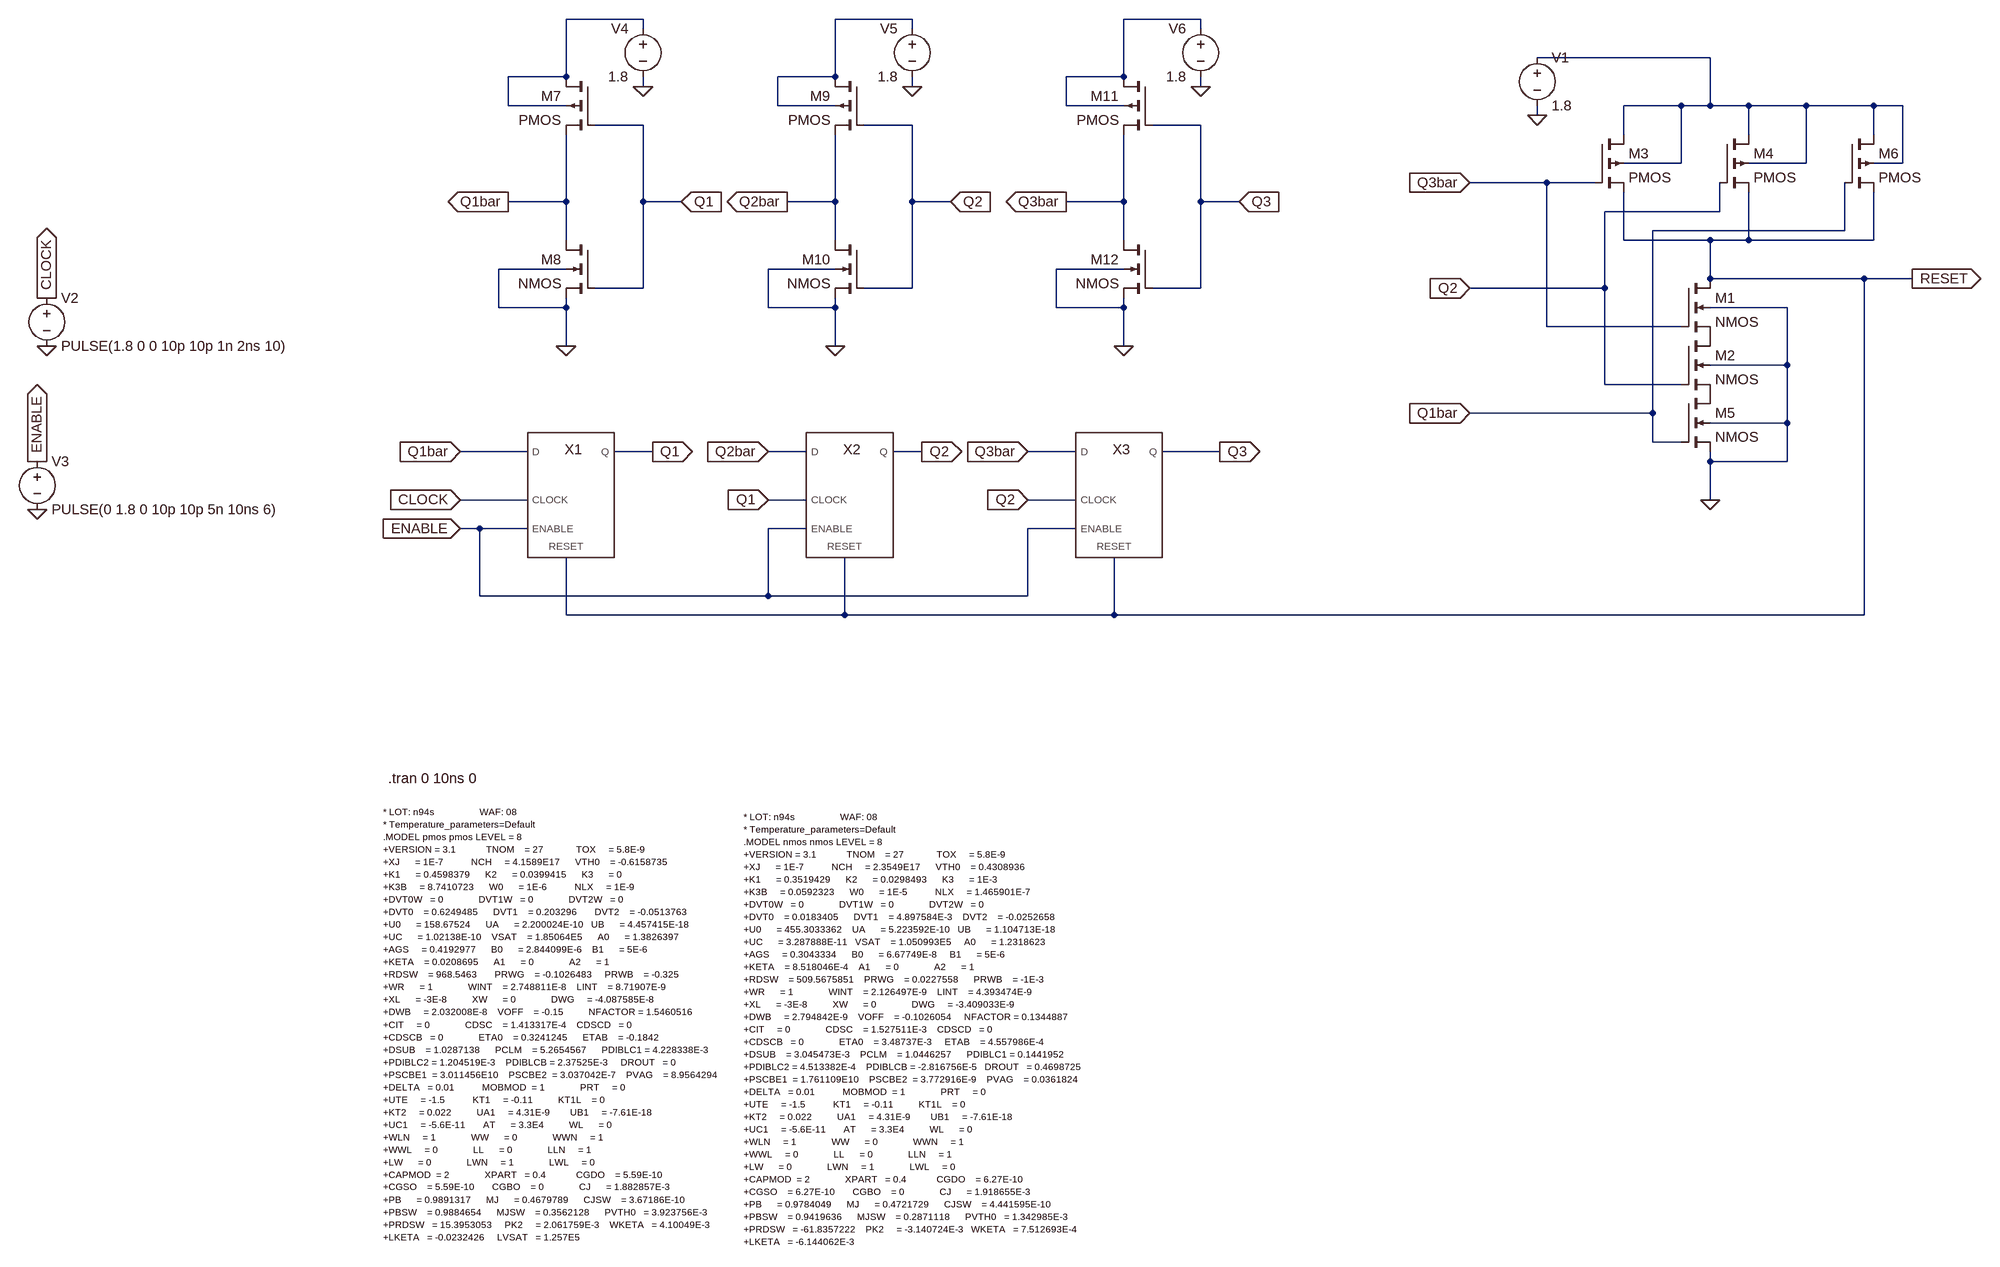
[diagram p0: schematic Mod5_Counter.asc]
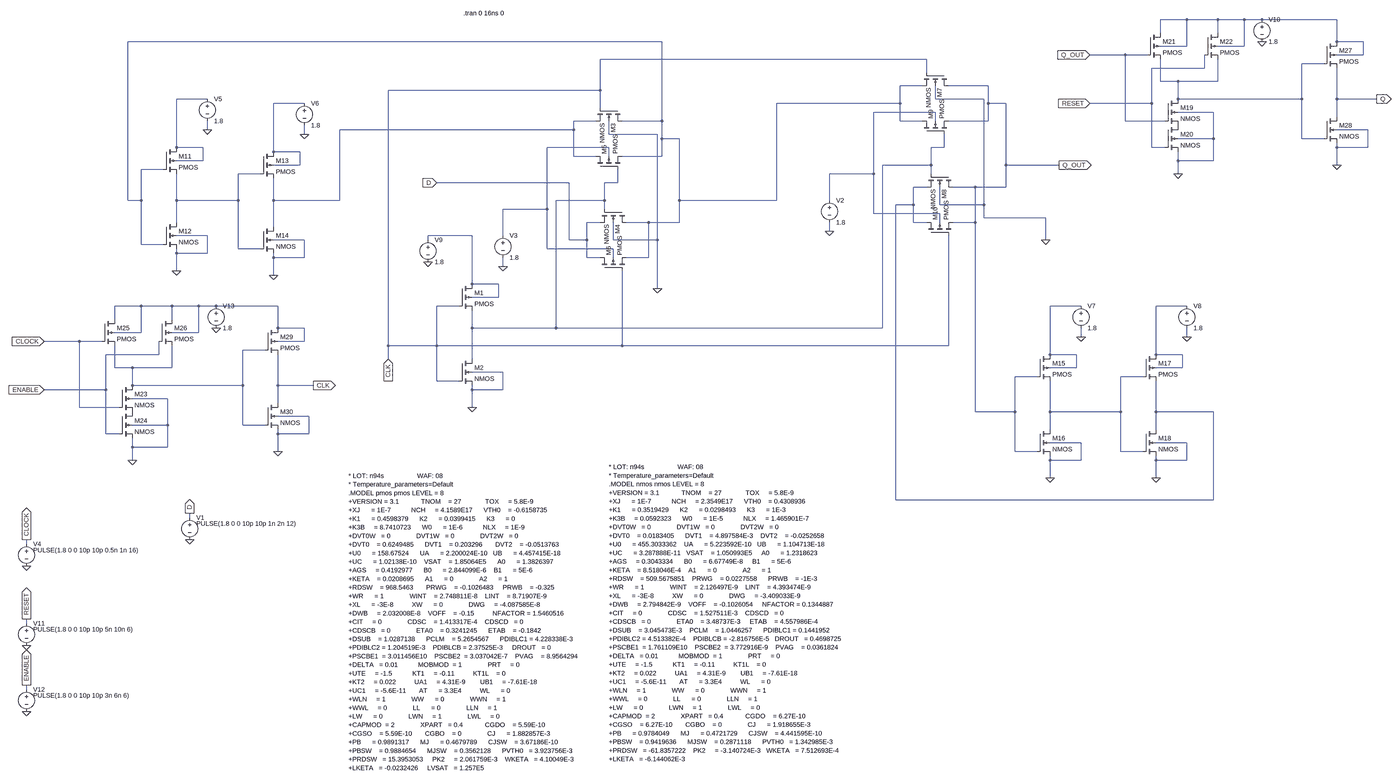
[diagram p1: sub-circuit dff_with_cntrs.asc, whole sheet]
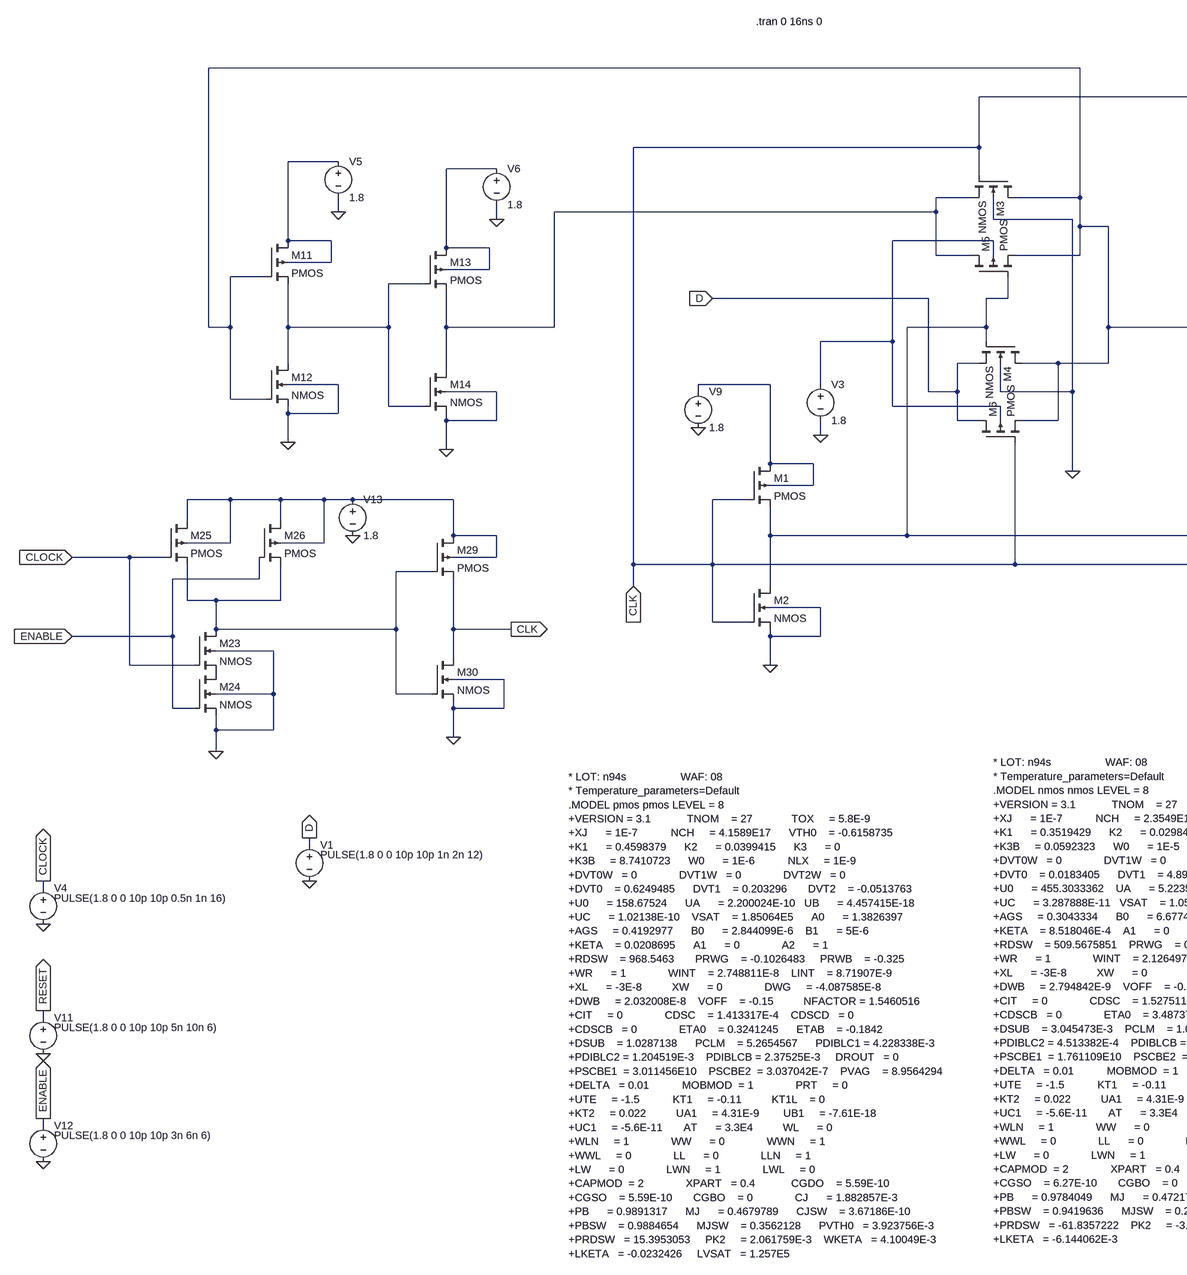
[diagram p2: sub-circuit dff_with_cntrs.asc, part, row 1 of 1, column 1 of 2]
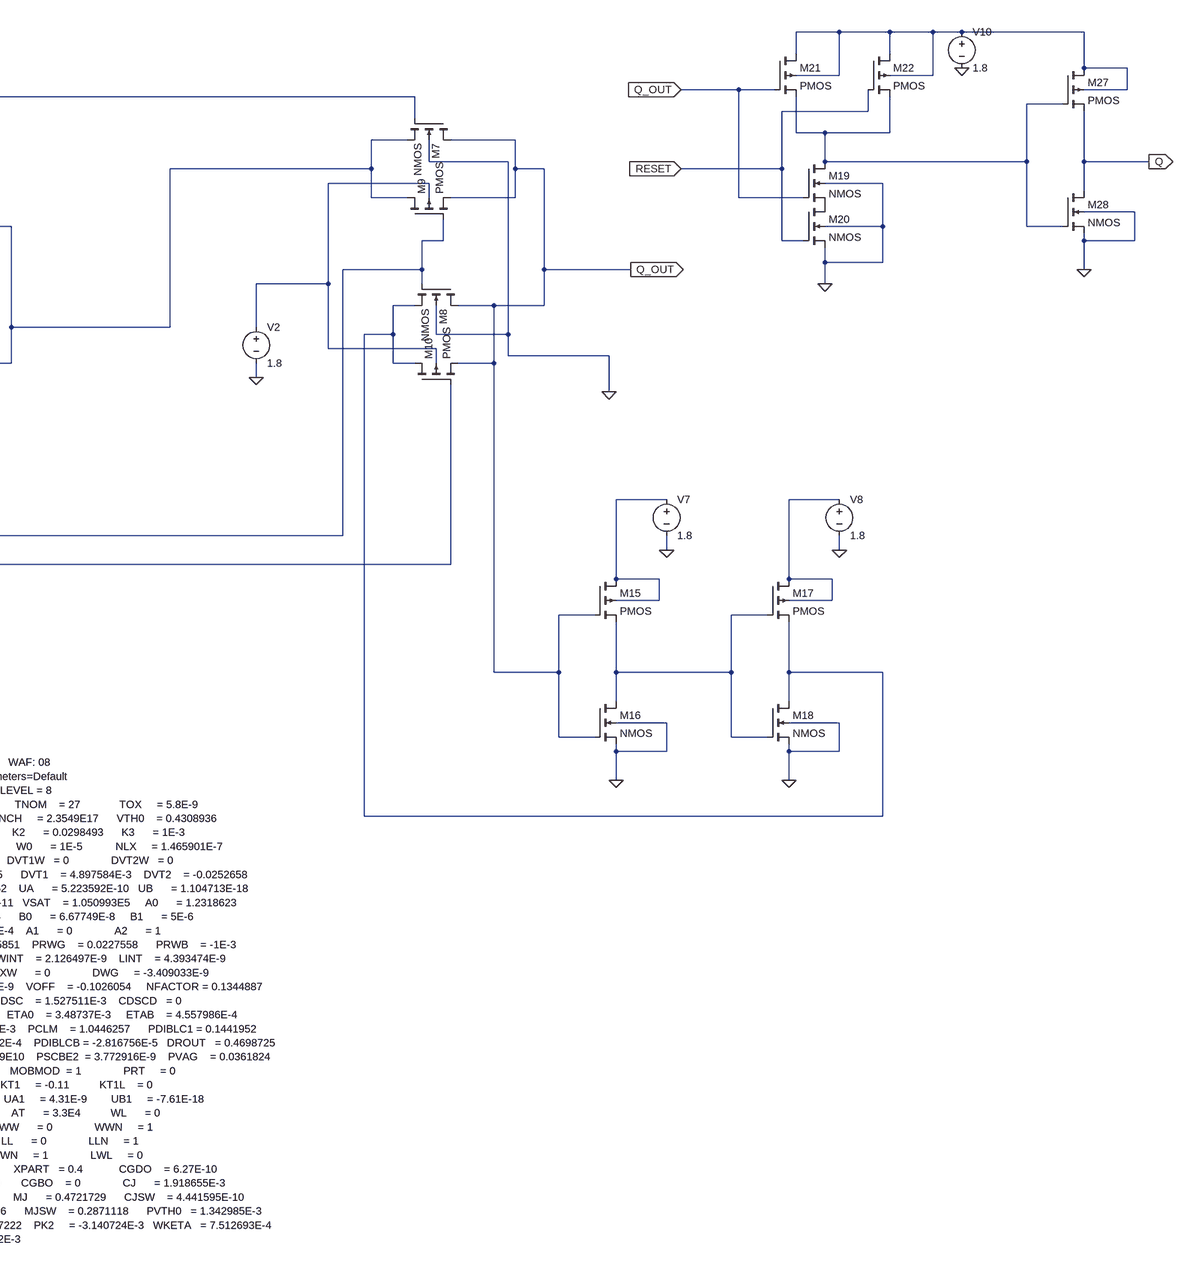
[diagram p3: sub-circuit dff_with_cntrs.asc, part, row 1 of 1, column 2 of 2]
Mod5_Counter.asc, the LTspice schematic file:
Version 4
SHEET 1 2244 1640
WIRE 16 -208 -112 -208
WIRE 464 -208 336 -208
WIRE 944 -208 816 -208
WIRE 16 -192 16 -208
WIRE 464 -192 464 -208
WIRE 944 -192 944 -208
WIRE 1792 -144 1504 -144
WIRE -112 -112 -112 -208
WIRE -112 -112 -208 -112
WIRE 336 -112 336 -208
WIRE 336 -112 240 -112
WIRE 816 -112 816 -208
WIRE 816 -112 720 -112
WIRE 16 -96 16 -112
WIRE 464 -96 464 -112
WIRE 944 -96 944 -112
WIRE -208 -64 -208 -112
WIRE -112 -64 -208 -64
WIRE 240 -64 240 -112
WIRE 336 -64 240 -64
WIRE 720 -64 720 -112
WIRE 816 -64 720 -64
WIRE 1744 -64 1648 -64
WIRE 1792 -64 1792 -144
WIRE 1792 -64 1744 -64
WIRE 1856 -64 1792 -64
WIRE 1952 -64 1856 -64
WIRE 2064 -64 1952 -64
WIRE 2112 -64 2064 -64
WIRE 1504 -48 1504 -64
WIRE 16 -32 -64 -32
WIRE 464 -32 384 -32
WIRE 944 -32 864 -32
WIRE 1648 -16 1648 -64
WIRE 1856 -16 1856 -64
WIRE 2064 -16 2064 -64
WIRE 1744 32 1744 -64
WIRE 1744 32 1648 32
WIRE 1952 32 1952 -64
WIRE 1952 32 1856 32
WIRE 2112 32 2112 -64
WIRE 2112 32 2064 32
WIRE 1520 64 1392 64
WIRE 1600 64 1520 64
WIRE -112 96 -112 -16
WIRE -112 96 -208 96
WIRE 16 96 16 -32
WIRE 80 96 16 96
WIRE 336 96 336 -16
WIRE 336 96 256 96
WIRE 464 96 464 -32
WIRE 528 96 464 96
WIRE 816 96 816 -16
WIRE 816 96 720 96
WIRE 944 96 944 -32
WIRE 1008 96 944 96
WIRE 1808 112 1808 64
WIRE 1808 112 1616 112
WIRE 2016 144 2016 64
WIRE 2016 144 1696 144
WIRE -112 160 -112 96
WIRE 336 160 336 96
WIRE 816 160 816 96
WIRE 1648 160 1648 80
WIRE 1792 160 1648 160
WIRE 1856 160 1856 80
WIRE 1856 160 1792 160
WIRE 2064 160 2064 80
WIRE 2064 160 1856 160
WIRE -112 208 -224 208
WIRE 336 208 224 208
WIRE 816 208 704 208
WIRE 1792 224 1792 160
WIRE 2048 224 1792 224
WIRE 2128 224 2048 224
WIRE 16 240 16 96
WIRE 16 240 -64 240
WIRE 464 240 464 96
WIRE 464 240 384 240
WIRE 944 240 944 96
WIRE 944 240 864 240
WIRE 1616 240 1616 112
WIRE 1616 240 1392 240
WIRE -224 272 -224 208
WIRE -112 272 -112 256
WIRE -112 272 -224 272
WIRE 224 272 224 208
WIRE 336 272 336 256
WIRE 336 272 224 272
WIRE 704 272 704 208
WIRE 816 272 816 256
WIRE 816 272 704 272
WIRE 1920 272 1792 272
WIRE 1520 304 1520 64
WIRE 1744 304 1520 304
WIRE -112 336 -112 272
WIRE 336 336 336 272
WIRE 816 336 816 272
WIRE 1920 368 1920 272
WIRE 1920 368 1792 368
WIRE 1616 400 1616 240
WIRE 1744 400 1616 400
WIRE 1696 448 1696 144
WIRE 1696 448 1392 448
WIRE 1920 464 1920 368
WIRE 1920 464 1792 464
WIRE 1696 496 1696 448
WIRE 1744 496 1696 496
WIRE -176 512 -288 512
WIRE 32 512 -32 512
WIRE 288 512 224 512
WIRE 480 512 432 512
WIRE 736 512 656 512
WIRE 976 512 880 512
WIRE 1792 528 1792 512
WIRE 1920 528 1920 464
WIRE 1920 528 1792 528
WIRE -176 592 -288 592
WIRE 288 592 224 592
WIRE 736 592 656 592
WIRE 1792 592 1792 528
WIRE -256 640 -288 640
WIRE -176 640 -256 640
WIRE 288 640 224 640
WIRE 736 640 656 640
WIRE -256 752 -256 640
WIRE 224 752 224 640
WIRE 224 752 -256 752
WIRE 656 752 656 640
WIRE 656 752 224 752
WIRE -112 784 -112 688
WIRE 352 784 352 688
WIRE 352 784 -112 784
WIRE 800 784 800 688
WIRE 800 784 352 784
WIRE 2048 784 2048 224
WIRE 2048 784 800 784
FLAG 1504 -48 0
FLAG -976 336 0
FLAG -992 608 0
FLAG 1792 592 0
FLAG -112 336 0
FLAG 16 -96 0
FLAG 336 336 0
FLAG 464 -96 0
FLAG 816 336 0
FLAG 944 -96 0
FLAG 80 96 Q1
IOPIN 80 96 In
FLAG 528 96 Q2
IOPIN 528 96 In
FLAG 1008 96 Q3
IOPIN 1008 96 In
FLAG 1392 64 Q3bar
IOPIN 1392 64 In
FLAG 1392 240 Q2
IOPIN 1392 240 In
FLAG 1392 448 Q1bar
IOPIN 1392 448 In
FLAG 656 512 Q3bar
IOPIN 656 512 In
FLAG 656 592 Q2
IOPIN 656 592 In
FLAG 224 512 Q2bar
IOPIN 224 512 In
FLAG 224 592 Q1
IOPIN 224 592 In
FLAG -288 512 Q1bar
IOPIN -288 512 In
FLAG -288 592 CLOCK
IOPIN -288 592 In
FLAG -288 640 ENABLE
IOPIN -288 640 In
FLAG 32 512 Q1
IOPIN 32 512 Out
FLAG 480 512 Q2
IOPIN 480 512 Out
FLAG 976 512 Q3
IOPIN 976 512 Out
FLAG 720 96 Q3bar
IOPIN 720 96 Out
FLAG 256 96 Q2bar
IOPIN 256 96 Out
FLAG -208 96 Q1bar
IOPIN -208 96 Out
FLAG -976 256 CLOCK
IOPIN -976 256 Out
FLAG -992 528 ENABLE
IOPIN -992 528 Out
FLAG 2128 224 RESET
IOPIN 2128 224 Out
SYMBOL nmos4 1744 224 R0
SYMATTR InstName M1
SYMATTR Value2 l=180n w=1320n
SYMBOL nmos4 1744 320 R0
SYMATTR InstName M2
SYMATTR Value2 l=180n w=1320n
SYMBOL pmos4 1600 -16 R0
SYMATTR InstName M3
SYMATTR Value2 l=180n w=880n
SYMBOL pmos4 1808 -16 R0
SYMATTR InstName M4
SYMATTR Value2 l=180n w=880n
SYMBOL Voltage 1504 -160 R0
SYMATTR InstName V1
SYMATTR Value 1.8
SYMBOL Voltage -976 240 R0
SYMATTR InstName V2
SYMATTR Value PULSE(1.8 0 0 10p 10p 1n 2ns 10)
SYMBOL Voltage -992 512 R0
SYMATTR InstName V3
SYMATTR Value PULSE(0 1.8 0 10p 10p 5n 10ns 6)
SYMBOL nmos4 1744 416 R0
SYMATTR InstName M5
SYMATTR Value2 l=180n w=1320n
SYMBOL pmos4 2016 -16 R0
SYMATTR InstName M6
SYMATTR Value2 l=180n w=880n
SYMBOL pmos4 -64 -112 M0
SYMATTR InstName M7
SYMATTR Value2 l=180n w=880n
SYMBOL nmos4 -64 160 M0
SYMATTR InstName M8
SYMATTR Value2 l=180n w=440n
SYMBOL Voltage 16 -208 M0
SYMATTR InstName V4
SYMATTR Value 1.8
SYMBOL pmos4 384 -112 M0
SYMATTR InstName M9
SYMATTR Value2 l=180n w=880n
SYMBOL nmos4 384 160 M0
SYMATTR InstName M10
SYMATTR Value2 l=180n w=440n
SYMBOL Voltage 464 -208 M0
SYMATTR InstName V5
SYMATTR Value 1.8
SYMBOL pmos4 864 -112 M0
SYMATTR InstName M11
SYMATTR Value2 l=180n w=880n
SYMBOL nmos4 864 160 M0
SYMATTR InstName M12
SYMATTR Value2 l=180n w=440n
SYMBOL Voltage 944 -208 M0
SYMATTR InstName V6
SYMATTR Value 1.8
SYMBOL DFF_With_Cntrs -112 592 R0
WINDOW 0 12 -68 Bottom 2
SYMATTR InstName X1
SYMBOL DFF_With_Cntrs 352 592 R0
WINDOW 0 12 -68 Bottom 2
SYMATTR InstName X2
SYMBOL DFF_With_Cntrs 800 592 R0
WINDOW 0 12 -68 Bottom 2
SYMATTR InstName X3
TEXT -416 1112 Left 1 !* LOT: n94s                  WAF: 08\n* Temperature_parameters=Default\n.MODEL pmos pmos LEVEL = 8\n+VERSION = 3.1            TNOM    = 27             TOX     = 5.8E-9\n+XJ      = 1E-7           NCH     = 4.1589E17      VTH0    = -0.6158735\n+K1      = 0.4598379      K2      = 0.0399415      K3      = 0\n+K3B     = 8.7410723      W0      = 1E-6           NLX     = 1E-9\n+DVT0W   = 0              DVT1W   = 0              DVT2W   = 0\n+DVT0    = 0.6249485      DVT1    = 0.203296       DVT2    = -0.0513763\n+U0      = 158.67524      UA      = 2.200024E-10   UB      = 4.457415E-18\n+UC      = 1.02138E-10    VSAT    = 1.85064E5      A0      = 1.3826397\n+AGS     = 0.4192977      B0      = 2.844099E-6    B1      = 5E-6\n+KETA    = 0.0208695      A1      = 0              A2      = 1\n+RDSW    = 968.5463       PRWG    = -0.1026483     PRWB    = -0.325\n+WR      = 1              WINT    = 2.748811E-8    LINT    = 8.71907E-9\n+XL      = -3E-8          XW      = 0              DWG     = -4.087585E-8\n+DWB     = 2.032008E-8    VOFF    = -0.15          NFACTOR = 1.5460516\n+CIT     = 0              CDSC    = 1.413317E-4    CDSCD   = 0\n+CDSCB   = 0              ETA0    = 0.3241245      ETAB    = -0.1842\n+DSUB    = 1.0287138      PCLM    = 5.2654567      PDIBLC1 = 4.228338E-3\n+PDIBLC2 = 1.204519E-3    PDIBLCB = 2.37525E-3     DROUT   = 0\n+PSCBE1  = 3.011456E10    PSCBE2  = 3.037042E-7    PVAG    = 8.9564294\n+DELTA   = 0.01           MOBMOD  = 1              PRT     = 0\n+UTE     = -1.5           KT1     = -0.11          KT1L    = 0\n+KT2     = 0.022          UA1     = 4.31E-9        UB1     = -7.61E-18\n+UC1     = -5.6E-11       AT      = 3.3E4          WL      = 0\n+WLN     = 1              WW      = 0              WWN     = 1\n+WWL     = 0              LL      = 0              LLN     = 1\n+LW      = 0              LWN     = 1              LWL     = 0\n+CAPMOD  = 2              XPART   = 0.4            CGDO    = 5.59E-10\n+CGSO    = 5.59E-10       CGBO    = 0              CJ      = 1.882857E-3\n+PB      = 0.9891317      MJ      = 0.4679789      CJSW    = 3.67186E-10\n+PBSW    = 0.9884654      MJSW    = 0.3562128      PVTH0   = 3.923756E-3\n+PRDSW   = 15.3953053     PK2     = 2.061759E-3    WKETA   = 4.10049E-3\n+LKETA   = -0.0232426     LVSAT   = 1.257E5
TEXT 184 1120 Left 1 !* LOT: n94s                  WAF: 08\n* Temperature_parameters=Default\n.MODEL nmos nmos LEVEL = 8\n+VERSION = 3.1            TNOM    = 27             TOX     = 5.8E-9\n+XJ      = 1E-7           NCH     = 2.3549E17      VTH0    = 0.4308936\n+K1      = 0.3519429      K2      = 0.0298493      K3      = 1E-3\n+K3B     = 0.0592323      W0      = 1E-5           NLX     = 1.465901E-7\n+DVT0W   = 0              DVT1W   = 0              DVT2W   = 0\n+DVT0    = 0.0183405      DVT1    = 4.897584E-3    DVT2    = -0.0252658\n+U0      = 455.3033362    UA      = 5.223592E-10   UB      = 1.104713E-18\n+UC      = 3.287888E-11   VSAT    = 1.050993E5     A0      = 1.2318623\n+AGS     = 0.3043334      B0      = 6.67749E-8     B1      = 5E-6\n+KETA    = 8.518046E-4    A1      = 0              A2      = 1\n+RDSW    = 509.5675851    PRWG    = 0.0227558      PRWB    = -1E-3\n+WR      = 1              WINT    = 2.126497E-9    LINT    = 4.393474E-9\n+XL      = -3E-8          XW      = 0              DWG     = -3.409033E-9\n+DWB     = 2.794842E-9    VOFF    = -0.1026054     NFACTOR = 0.1344887\n+CIT     = 0              CDSC    = 1.527511E-3    CDSCD   = 0\n+CDSCB   = 0              ETA0    = 3.48737E-3     ETAB    = 4.557986E-4\n+DSUB    = 3.045473E-3    PCLM    = 1.0446257      PDIBLC1 = 0.1441952\n+PDIBLC2 = 4.513382E-4    PDIBLCB = -2.816756E-5   DROUT   = 0.4698725\n+PSCBE1  = 1.761109E10    PSCBE2  = 3.772916E-9    PVAG    = 0.0361824\n+DELTA   = 0.01           MOBMOD  = 1              PRT     = 0\n+UTE     = -1.5           KT1     = -0.11          KT1L    = 0\n+KT2     = 0.022          UA1     = 4.31E-9        UB1     = -7.61E-18\n+UC1     = -5.6E-11       AT      = 3.3E4          WL      = 0\n+WLN     = 1              WW      = 0              WWN     = 1\n+WWL     = 0              LL      = 0              LLN     = 1\n+LW      = 0              LWN     = 1              LWL     = 0\n+CAPMOD  = 2              XPART   = 0.4            CGDO    = 6.27E-10\n+CGSO    = 6.27E-10       CGBO    = 0              CJ      = 1.918655E-3\n+PB      = 0.9784049      MJ      = 0.4721729      CJSW    = 4.441595E-10\n+PBSW    = 0.9419636      MJSW    = 0.2871118      PVTH0   = 1.342985E-3\n+PRDSW   = -61.8357222    PK2     = -3.140724E-3   WKETA   = 7.512693E-4\n+LKETA   = -6.144062E-3
TEXT -408 1056 Left 2 !.tran 0 10ns 0

dff_with_cntrs.asc, the sub-circuit schematic file:
Version 4
SHEET 1 2416 1696
WIRE 1664 -832 1568 -832
WIRE 1776 -832 1664 -832
WIRE 1872 -832 1776 -832
WIRE 1936 -832 1872 -832
WIRE 2208 -832 1936 -832
WIRE 1568 -784 1568 -832
WIRE 1776 -784 1776 -832
WIRE -240 -752 -2176 -752
WIRE 2208 -752 2208 -832
WIRE 2304 -752 2208 -752
WIRE 1664 -736 1664 -832
WIRE 1664 -736 1568 -736
WIRE 1872 -736 1872 -832
WIRE 1872 -736 1776 -736
WIRE 1440 -704 1312 -704
WIRE 1520 -704 1440 -704
WIRE 2304 -704 2304 -752
WIRE 2304 -704 2208 -704
WIRE 720 -688 -464 -688
WIRE 2160 -672 2080 -672
WIRE 1728 -656 1728 -704
WIRE 1728 -656 1536 -656
WIRE 720 -640 720 -688
WIRE 1568 -608 1568 -688
WIRE 1632 -608 1568 -608
WIRE 1776 -608 1776 -688
WIRE 1776 -608 1632 -608
WIRE 704 -592 624 -592
WIRE 944 -592 800 -592
WIRE -464 -576 -464 -688
WIRE -464 -576 -1232 -576
WIRE -1888 -544 -2000 -544
WIRE 752 -544 752 -592
WIRE 928 -544 752 -544
WIRE 1632 -544 1632 -608
WIRE 2080 -544 2080 -672
WIRE 2080 -544 1632 -544
WIRE 2208 -544 2208 -656
WIRE 2352 -544 2208 -544
WIRE -1536 -528 -1648 -528
WIRE 624 -528 624 -592
WIRE 624 -528 176 -528
WIRE 944 -528 944 -592
WIRE 1008 -528 944 -528
WIRE 1536 -528 1536 -656
WIRE 1536 -528 1312 -528
WIRE -464 -512 -464 -576
WIRE 752 -496 528 -496
WIRE 1760 -496 1632 -496
WIRE 2208 -480 2208 -544
WIRE -480 -464 -560 -464
WIRE -240 -464 -240 -752
WIRE -240 -464 -384 -464
WIRE 624 -464 624 -528
WIRE 704 -464 624 -464
WIRE 752 -464 752 -496
WIRE 944 -464 944 -528
WIRE 944 -464 800 -464
WIRE 1440 -464 1440 -704
WIRE 1584 -464 1440 -464
WIRE -1888 -432 -1888 -464
WIRE -560 -432 -560 -464
WIRE -560 -432 -1408 -432
WIRE 2320 -432 2208 -432
WIRE -1536 -416 -1536 -448
WIRE -432 -416 -432 -464
WIRE -256 -416 -432 -416
WIRE -240 -400 -240 -464
WIRE -176 -400 -240 -400
WIRE 1760 -400 1760 -496
WIRE 1760 -400 1632 -400
WIRE 2080 -400 2080 -544
WIRE 2160 -400 2080 -400
WIRE -2000 -368 -2000 -544
WIRE -1904 -368 -2000 -368
WIRE -432 -368 -656 -368
WIRE 784 -368 784 -416
WIRE 784 -368 736 -368
WIRE 1536 -368 1536 -528
WIRE 1584 -368 1536 -368
WIRE 2208 -368 2208 -384
WIRE 2320 -368 2320 -432
WIRE 2320 -368 2208 -368
WIRE -1648 -352 -1648 -528
WIRE -1552 -352 -1648 -352
WIRE -560 -336 -560 -432
WIRE -480 -336 -560 -336
WIRE -432 -336 -432 -368
WIRE -240 -336 -240 -400
WIRE -240 -336 -384 -336
WIRE -1904 -320 -1904 -368
WIRE -1904 -320 -2000 -320
WIRE 1632 -320 1632 -352
WIRE 1760 -320 1760 -400
WIRE 1760 -320 1632 -320
WIRE -1552 -304 -1552 -352
WIRE -1552 -304 -1648 -304
WIRE 736 -304 736 -368
WIRE 736 -304 560 -304
WIRE 1008 -304 1008 -528
WIRE 1200 -304 1008 -304
WIRE 2208 -304 2208 -368
WIRE -2048 -288 -2128 -288
WIRE -1696 -272 -1776 -272
WIRE 528 -272 528 -496
WIRE 528 -272 368 -272
WIRE 736 -272 736 -304
WIRE 1632 -272 1632 -320
WIRE -576 -240 -1056 -240
WIRE -400 -240 -400 -288
WIRE -400 -240 -448 -240
WIRE 720 -224 672 -224
WIRE 896 -224 816 -224
WIRE 1008 -224 1008 -304
WIRE 1008 -224 896 -224
WIRE -2176 -176 -2176 -752
WIRE -2128 -176 -2128 -288
WIRE -2128 -176 -2176 -176
WIRE -2000 -176 -2000 -272
WIRE -1776 -176 -1776 -272
WIRE -1776 -176 -2000 -176
WIRE -1648 -176 -1648 -256
WIRE -1408 -176 -1408 -432
WIRE -1408 -176 -1648 -176
WIRE -448 -176 -448 -240
WIRE -448 -176 -624 -176
WIRE -176 -176 -176 -400
WIRE 176 -176 176 -528
WIRE 176 -176 -176 -176
WIRE 368 -176 368 -272
WIRE 672 -160 672 -224
WIRE 672 -160 608 -160
WIRE 768 -160 768 -224
WIRE 928 -160 928 -544
WIRE 928 -160 768 -160
WIRE -656 -144 -656 -368
WIRE -656 -144 -816 -144
WIRE -448 -144 -448 -176
WIRE 528 -128 528 -272
WIRE 768 -128 528 -128
WIRE 928 -112 928 -160
WIRE 1152 -112 928 -112
WIRE -2000 -96 -2000 -176
WIRE -464 -96 -512 -96
WIRE -288 -96 -368 -96
WIRE -176 -96 -176 -176
WIRE -176 -96 -288 -96
WIRE 672 -96 672 -160
WIRE 720 -96 672 -96
WIRE 768 -96 768 -128
WIRE 896 -96 896 -224
WIRE 896 -96 816 -96
WIRE -1648 -80 -1648 -176
WIRE 368 -64 368 -96
WIRE -1888 -48 -2000 -48
WIRE -928 -48 -1088 -48
WIRE -816 -48 -816 -144
WIRE -1536 -32 -1648 -32
WIRE -1088 -32 -1088 -48
WIRE -576 -32 -576 -240
WIRE -512 -32 -512 -96
WIRE -512 -32 -576 -32
WIRE -416 -32 -416 -96
WIRE -256 -32 -256 -416
WIRE -256 -32 -416 -32
WIRE 1152 -32 1152 -112
WIRE -2128 -16 -2128 -176
WIRE -2048 -16 -2128 -16
WIRE -1776 0 -1776 -176
WIRE -1696 0 -1776 0
WIRE -656 0 -656 -144
WIRE -416 0 -656 0
WIRE -2000 16 -2000 0
WIRE -1888 16 -1888 -48
WIRE -1888 16 -2000 16
WIRE -1648 32 -1648 16
WIRE -1536 32 -1536 -32
WIRE -1536 32 -1648 32
WIRE -512 32 -512 -32
WIRE -464 32 -512 32
WIRE -416 32 -416 0
WIRE -288 32 -288 -96
WIRE -288 32 -368 32
WIRE -816 64 -816 32
WIRE -2000 80 -2000 16
WIRE -1648 96 -1648 32
WIRE -928 128 -928 -48
WIRE -832 128 -928 128
WIRE -256 144 -256 -32
WIRE -832 176 -832 128
WIRE -832 176 -928 176
WIRE -2128 208 -2224 208
WIRE -2016 208 -2128 208
WIRE -1920 208 -2016 208
WIRE -1856 208 -1920 208
WIRE -1632 208 -1856 208
WIRE -976 208 -1056 208
WIRE 1280 208 1168 208
WIRE 1664 208 1552 208
WIRE -2224 256 -2224 208
WIRE -2016 256 -2016 208
WIRE -1632 288 -1632 208
WIRE -1536 288 -1632 288
WIRE -928 288 -928 224
WIRE -624 288 -624 -176
WIRE -624 288 -928 288
WIRE 560 288 560 -304
WIRE 560 288 -624 288
WIRE -2128 304 -2128 208
WIRE -2128 304 -2224 304
WIRE -1920 304 -1920 208
WIRE -1920 304 -2016 304
WIRE 1280 320 1280 288
WIRE 1664 320 1664 288
WIRE -2352 336 -2480 336
WIRE -2272 336 -2352 336
WIRE -1536 336 -1536 288
WIRE -1536 336 -1632 336
WIRE -1232 352 -1232 -576
WIRE -1056 352 -1056 208
WIRE -1056 352 -1232 352
WIRE -384 352 -384 80
WIRE -384 352 -1056 352
WIRE 800 352 800 -48
WIRE 800 352 -384 352
WIRE -1680 368 -1760 368
WIRE -2064 384 -2064 336
WIRE -2064 384 -2256 384
WIRE 1168 384 1168 208
WIRE 1264 384 1168 384
WIRE 1552 384 1552 208
WIRE 1648 384 1552 384
WIRE -1232 400 -1232 352
WIRE -928 400 -928 288
WIRE -2224 432 -2224 352
WIRE -2160 432 -2224 432
WIRE -2016 432 -2016 352
WIRE -2016 432 -2160 432
WIRE 1264 432 1264 384
WIRE 1264 432 1168 432
WIRE 1648 432 1648 384
WIRE 1648 432 1552 432
WIRE -816 448 -928 448
WIRE 1120 464 1040 464
WIRE 1504 464 1424 464
WIRE -1056 480 -1056 352
WIRE -976 480 -1056 480
WIRE -2160 496 -2160 432
WIRE -1760 496 -1760 368
WIRE -1760 496 -2160 496
WIRE -1632 496 -1632 384
WIRE -1504 496 -1632 496
WIRE -2256 512 -2256 384
WIRE -2256 512 -2480 512
WIRE -928 512 -928 496
WIRE -816 512 -816 448
WIRE -816 512 -928 512
WIRE -2032 544 -2160 544
WIRE -1632 560 -1632 496
WIRE -2352 576 -2352 336
WIRE -2208 576 -2352 576
WIRE -928 576 -928 512
WIRE 896 592 896 -96
WIRE 1040 592 1040 464
WIRE 1040 592 896 592
WIRE 1168 592 1168 480
WIRE 1424 592 1424 464
WIRE 1424 592 1168 592
WIRE 1552 592 1552 480
WIRE 1760 592 1552 592
WIRE -1520 608 -1632 608
WIRE -2032 640 -2032 544
WIRE -2032 640 -2160 640
WIRE -1760 640 -1760 496
WIRE -1680 640 -1760 640
WIRE 1168 656 1168 592
WIRE 1552 656 1552 592
WIRE -2256 672 -2256 512
WIRE -2208 672 -2256 672
WIRE -1632 672 -1632 656
WIRE -1520 672 -1520 608
WIRE -1520 672 -1632 672
WIRE 1280 704 1168 704
WIRE 1664 704 1552 704
WIRE -2160 720 -2160 688
WIRE -2032 720 -2032 640
WIRE -2032 720 -2160 720
WIRE -1632 736 -1632 672
WIRE 1040 736 1040 592
WIRE 1120 736 1040 736
WIRE 1424 736 1424 592
WIRE 1504 736 1424 736
WIRE -2160 768 -2160 720
WIRE 1168 768 1168 752
WIRE 1280 768 1280 704
WIRE 1280 768 1168 768
WIRE 1552 768 1552 752
WIRE 1664 768 1664 704
WIRE 1664 768 1552 768
WIRE 1168 832 1168 768
WIRE 1552 832 1552 768
WIRE 608 912 608 -160
WIRE 1760 912 1760 592
WIRE 1760 912 608 912
WIRE -1952 976 -1952 960
WIRE -2544 1072 -2544 1056
WIRE -2544 1360 -2544 1344
WIRE -2544 1600 -2544 1584
FLAG -2544 1152 0
FLAG -928 576 0
FLAG -816 64 0
FLAG -256 144 0
FLAG 368 -64 0
FLAG 1152 -32 0
FLAG -2000 80 0
FLAG -1888 -432 0
FLAG -1648 96 0
FLAG -1536 -416 0
FLAG 1168 832 0
FLAG 1280 320 0
FLAG 1552 832 0
FLAG 1664 320 0
FLAG -1088 48 0
FLAG 1936 -752 0
FLAG 1632 -272 0
FLAG -1856 288 0
FLAG -2160 768 0
FLAG -2480 512 ENABLE
IOPIN -2480 512 In
FLAG 1312 -528 RESET
IOPIN 1312 -528 In
FLAG 1312 -704 Q_OUT
IOPIN 1312 -704 In
FLAG -2480 336 CLOCK
IOPIN -2480 336 In
FLAG -2544 1056 CLOCK
IOPIN -2544 1056 Out
FLAG -1504 496 CLK
IOPIN -1504 496 Out
FLAG 2352 -544 Q
IOPIN 2352 -544 Out
FLAG -1232 400 CLK
IOPIN -1232 400 In
FLAG 1200 -304 Q_OUT
IOPIN 1200 -304 Out
FLAG 2208 -304 0
FLAG -1632 736 0
FLAG -2544 1440 0
FLAG -2544 1344 RESET
IOPIN -2544 1344 Out
FLAG -2544 1680 0
FLAG -2544 1584 ENABLE
IOPIN -2544 1584 Out
FLAG -1056 -240 D
IOPIN -1056 -240 In
FLAG -1952 1056 0
FLAG -1952 960 D
IOPIN -1952 960 Out
SYMBOL nmos4 -384 -512 R90
SYMATTR InstName M3
SYMATTR Value2 l=180n w=440n
SYMBOL nmos4 -368 -144 R90
SYMATTR InstName M4
SYMATTR Value2 l=180n w=440n
SYMBOL pmos4 -976 128 R0
SYMATTR InstName M1
SYMATTR Value2 l=180n w=880n
SYMBOL nmos4 -976 400 R0
SYMATTR InstName M2
SYMATTR Value2 l=180n w=440n
SYMBOL voltage -816 -64 R0
SYMATTR InstName V3
SYMATTR Value 1.8
SYMBOL voltage -2544 1056 R0
WINDOW 3 24 38 Left 2
SYMATTR Value PULSE(1.8 0 0 10p 10p 0.5n 1n 16)
SYMATTR InstName V4
SYMBOL pmos4 -480 -288 R270
SYMATTR InstName M5
SYMATTR Value2 l=180n w=440n
SYMBOL pmos4 -464 80 R270
SYMATTR InstName M6
SYMATTR Value2 l=180n w=440n
SYMBOL nmos4 800 -640 R90
SYMATTR InstName M7
SYMATTR Value2 l=180n w=440n
SYMBOL nmos4 816 -272 R90
SYMATTR InstName M8
SYMATTR Value2 l=180n w=440n
SYMBOL voltage 368 -192 R0
SYMATTR InstName V2
SYMATTR Value 1.8
SYMBOL pmos4 704 -416 R270
SYMATTR InstName M9
SYMATTR Value2 l=180n w=440n
SYMBOL pmos4 720 -48 R270
SYMATTR InstName M10
SYMATTR Value2 l=180n w=440n
SYMBOL pmos4 -2048 -368 R0
SYMATTR InstName M11
SYMATTR Value2 l=180n w=880n
SYMBOL nmos4 -2048 -96 R0
SYMATTR InstName M12
SYMATTR Value2 l=180n w=440n
SYMBOL voltage -1888 -560 R0
SYMATTR InstName V5
SYMATTR Value 1.8
SYMBOL pmos4 -1696 -352 R0
SYMATTR InstName M13
SYMATTR Value2 l=180n w=880n
SYMBOL nmos4 -1696 -80 R0
SYMATTR InstName M14
SYMATTR Value2 l=180n w=440n
SYMBOL voltage -1536 -544 R0
SYMATTR InstName V6
SYMATTR Value 1.8
SYMBOL pmos4 1120 384 R0
SYMATTR InstName M15
SYMATTR Value2 l=180n w=880n
SYMBOL nmos4 1120 656 R0
SYMATTR InstName M16
SYMATTR Value2 l=180n w=440n
SYMBOL voltage 1280 192 R0
SYMATTR InstName V7
SYMATTR Value 1.8
SYMBOL pmos4 1504 384 R0
SYMATTR InstName M17
SYMATTR Value2 l=180n w=880n
SYMBOL nmos4 1504 656 R0
SYMATTR InstName M18
SYMATTR Value2 l=180n w=440n
SYMBOL voltage 1664 192 R0
SYMATTR InstName V8
SYMATTR Value 1.8
SYMBOL Voltage -1088 -48 R0
SYMATTR InstName V9
SYMATTR Value 1.8
SYMBOL nmos4 1584 -544 R0
SYMATTR InstName M19
SYMATTR Value2 l=180n w=880n
SYMBOL nmos4 1584 -448 R0
SYMATTR InstName M20
SYMATTR Value2 l=180n w=880n
SYMBOL pmos4 1520 -784 R0
SYMATTR InstName M21
SYMATTR Value2 l=180n w=880n
SYMBOL pmos4 1728 -784 R0
SYMATTR InstName M22
SYMATTR Value2 l=180n w=880n
SYMBOL Voltage 1936 -848 R0
SYMATTR InstName V10
SYMATTR Value 1.8
SYMBOL nmos4 -2208 496 R0
SYMATTR InstName M23
SYMATTR Value2 l=180n w=880n
SYMBOL nmos4 -2208 592 R0
SYMATTR InstName M24
SYMATTR Value2 l=180n w=880n
SYMBOL pmos4 -2272 256 R0
SYMATTR InstName M25
SYMATTR Value2 l=180n w=880n
SYMBOL pmos4 -2064 256 R0
SYMATTR InstName M26
SYMATTR Value2 l=180n w=880n
SYMBOL Voltage -1856 192 R0
SYMATTR InstName V13
SYMATTR Value 1.8
SYMBOL pmos4 2160 -752 R0
SYMATTR InstName M27
SYMATTR Value2 l=180n w=880n
SYMBOL nmos4 2160 -480 R0
SYMATTR InstName M28
SYMATTR Value2 l=180n w=440n
SYMBOL pmos4 -1680 288 R0
SYMATTR InstName M29
SYMATTR Value2 l=180n w=880n
SYMBOL nmos4 -1680 560 R0
SYMATTR InstName M30
SYMATTR Value2 l=180n w=440n
SYMBOL voltage -2544 1344 R0
WINDOW 3 24 38 Left 2
SYMATTR Value PULSE(1.8 0 0 10p 10p 5n 10n 6)
SYMATTR InstName V11
SYMBOL voltage -2544 1584 R0
WINDOW 3 24 38 Left 2
SYMATTR Value PULSE(1.8 0 0 10p 10p 3n 6n 6)
SYMATTR InstName V12
SYMBOL voltage -1952 960 R0
WINDOW 3 24 38 Left 2
SYMATTR Value PULSE(1.8 0 0 10p 10p 1n 2n 12)
SYMATTR InstName V1
TEXT -960 -856 Left 2 !.tran 0 16ns 0
TEXT -432 792 Left 2 !* LOT: n94s                  WAF: 08\n* Temperature_parameters=Default\n.MODEL nmos nmos LEVEL = 8\n+VERSION = 3.1            TNOM    = 27             TOX     = 5.8E-9\n+XJ      = 1E-7           NCH     = 2.3549E17      VTH0    = 0.4308936\n+K1      = 0.3519429      K2      = 0.0298493      K3      = 1E-3\n+K3B     = 0.0592323      W0      = 1E-5           NLX     = 1.465901E-7\n+DVT0W   = 0              DVT1W   = 0              DVT2W   = 0\n+DVT0    = 0.0183405      DVT1    = 4.897584E-3    DVT2    = -0.0252658\n+U0      = 455.3033362    UA      = 5.223592E-10   UB      = 1.104713E-18\n+UC      = 3.287888E-11   VSAT    = 1.050993E5     A0      = 1.2318623\n+AGS     = 0.3043334      B0      = 6.67749E-8     B1      = 5E-6\n+KETA    = 8.518046E-4    A1      = 0              A2      = 1\n+RDSW    = 509.5675851    PRWG    = 0.0227558      PRWB    = -1E-3\n+WR      = 1              WINT    = 2.126497E-9    LINT    = 4.393474E-9\n+XL      = -3E-8          XW      = 0              DWG     = -3.409033E-9\n+DWB     = 2.794842E-9    VOFF    = -0.1026054     NFACTOR = 0.1344887\n+CIT     = 0              CDSC    = 1.527511E-3    CDSCD   = 0\n+CDSCB   = 0              ETA0    = 3.48737E-3     ETAB    = 4.557986E-4\n+DSUB    = 3.045473E-3    PCLM    = 1.0446257      PDIBLC1 = 0.1441952\n+PDIBLC2 = 4.513382E-4    PDIBLCB = -2.816756E-5   DROUT   = 0.4698725\n+PSCBE1  = 1.761109E10    PSCBE2  = 3.772916E-9    PVAG    = 0.0361824\n+DELTA   = 0.01           MOBMOD  = 1              PRT     = 0\n+UTE     = -1.5           KT1     = -0.11          KT1L    = 0\n+KT2     = 0.022          UA1     = 4.31E-9        UB1     = -7.61E-18\n+UC1     = -5.6E-11       AT      = 3.3E4          WL      = 0\n+WLN     = 1              WW      = 0              WWN     = 1\n+WWL     = 0              LL      = 0              LLN     = 1\n+LW      = 0              LWN     = 1              LWL     = 0\n+CAPMOD  = 2              XPART   = 0.4            CGDO    = 6.27E-10\n+CGSO    = 6.27E-10       CGBO    = 0              CJ      = 1.918655E-3\n+PB      = 0.9784049      MJ      = 0.4721729      CJSW    = 4.441595E-10\n+PBSW    = 0.9419636      MJSW    = 0.2871118      PVTH0   = 1.342985E-3\n+PRDSW   = -61.8357222    PK2     = -3.140724E-3   WKETA   = 7.512693E-4\n+LKETA   = -6.144062E-3
TEXT -1376 824 Left 2 !* LOT: n94s                  WAF: 08\n* Temperature_parameters=Default\n.MODEL pmos pmos LEVEL = 8\n+VERSION = 3.1            TNOM    = 27             TOX     = 5.8E-9\n+XJ      = 1E-7           NCH     = 4.1589E17      VTH0    = -0.6158735\n+K1      = 0.4598379      K2      = 0.0399415      K3      = 0\n+K3B     = 8.7410723      W0      = 1E-6           NLX     = 1E-9\n+DVT0W   = 0              DVT1W   = 0              DVT2W   = 0\n+DVT0    = 0.6249485      DVT1    = 0.203296       DVT2    = -0.0513763\n+U0      = 158.67524      UA      = 2.200024E-10   UB      = 4.457415E-18\n+UC      = 1.02138E-10    VSAT    = 1.85064E5      A0      = 1.3826397\n+AGS     = 0.4192977      B0      = 2.844099E-6    B1      = 5E-6\n+KETA    = 0.0208695      A1      = 0              A2      = 1\n+RDSW    = 968.5463       PRWG    = -0.1026483     PRWB    = -0.325\n+WR      = 1              WINT    = 2.748811E-8    LINT    = 8.71907E-9\n+XL      = -3E-8          XW      = 0              DWG     = -4.087585E-8\n+DWB     = 2.032008E-8    VOFF    = -0.15          NFACTOR = 1.5460516\n+CIT     = 0              CDSC    = 1.413317E-4    CDSCD   = 0\n+CDSCB   = 0              ETA0    = 0.3241245      ETAB    = -0.1842\n+DSUB    = 1.0287138      PCLM    = 5.2654567      PDIBLC1 = 4.228338E-3\n+PDIBLC2 = 1.204519E-3    PDIBLCB = 2.37525E-3     DROUT   = 0\n+PSCBE1  = 3.011456E10    PSCBE2  = 3.037042E-7    PVAG    = 8.9564294\n+DELTA   = 0.01           MOBMOD  = 1              PRT     = 0\n+UTE     = -1.5           KT1     = -0.11          KT1L    = 0\n+KT2     = 0.022          UA1     = 4.31E-9        UB1     = -7.61E-18\n+UC1     = -5.6E-11       AT      = 3.3E4          WL      = 0\n+WLN     = 1              WW      = 0              WWN     = 1\n+WWL     = 0              LL      = 0              LLN     = 1\n+LW      = 0              LWN     = 1              LWL     = 0\n+CAPMOD  = 2              XPART   = 0.4            CGDO    = 5.59E-10\n+CGSO    = 5.59E-10       CGBO    = 0              CJ      = 1.882857E-3\n+PB      = 0.9891317      MJ      = 0.4679789      CJSW    = 3.67186E-10\n+PBSW    = 0.9884654      MJSW    = 0.3562128      PVTH0   = 3.923756E-3\n+PRDSW   = 15.3953053     PK2     = 2.061759E-3    WKETA   = 4.10049E-3\n+LKETA   = -0.0232426     LVSAT   = 1.257E5

The netlist it stands for:
* Mod5_Counter.asc
M1 RESET Q3bar P001 0 NMOS l=180n w=1320n
M2 P001 Q2 P002 0 NMOS l=180n w=1320n
M3 N004 Q3bar RESET N004 PMOS l=180n w=880n
M4 N004 Q2 RESET N004 PMOS l=180n w=880n
V1 N004 0 1.8
V2 CLOCK 0 PULSE(1.8 0 0 10p 10p 1n 2ns 10)
V3 ENABLE 0 PULSE(0 1.8 0 10p 10p 5n 10ns 6)
M5 P002 Q1bar 0 0 NMOS l=180n w=1320n
M6 N004 Q1bar RESET N004 PMOS l=180n w=880n
M7 N001 Q1 Q1bar N001 PMOS l=180n w=880n
M8 Q1bar Q1 0 0 NMOS l=180n w=440n
V4 N001 0 1.8
M9 N002 Q2 Q2bar N002 PMOS l=180n w=880n
M10 Q2bar Q2 0 0 NMOS l=180n w=440n
V5 N002 0 1.8
M11 N003 Q3 Q3bar N003 PMOS l=180n w=880n
M12 Q3bar Q3 0 0 NMOS l=180n w=440n
V6 N003 0 1.8
XX1 CLOCK Q1bar ENABLE RESET Q1 dff_with_cntrs
XX2 Q1 Q2bar ENABLE RESET Q2 dff_with_cntrs
XX3 Q2 Q3bar ENABLE RESET Q3 dff_with_cntrs

* block symbol definitions
.subckt dff_with_cntrs CLOCK D ENABLE RESET Q
M3 N002 CLK N007 0 NMOS l=180n w=440n
M4 N002 N009 D 0 NMOS l=180n w=440n
M1 N012 CLK N009 N012 PMOS l=180n w=880n
M2 N009 CLK 0 0 NMOS l=180n w=440n
V3 N008 0 1.8
V4 CLOCK 0 PULSE(1.8 0 0 10p 10p 0.5n 1n 16)
M5 N007 N009 N002 N008 PMOS l=180n w=440n
M6 D CLK N002 N008 PMOS l=180n w=440n
M7 Q_OUT CLK N002 0 NMOS l=180n w=440n
M8 Q_OUT N009 N011 0 NMOS l=180n w=440n
V2 N006 0 1.8
M9 N002 N009 Q_OUT N006 PMOS l=180n w=440n
M10 N011 CLK Q_OUT N006 PMOS l=180n w=440n
M11 N004 N002 N010 N004 PMOS l=180n w=880n
M12 N010 N002 0 0 NMOS l=180n w=440n
V5 N004 0 1.8
M13 N005 N010 N007 N005 PMOS l=180n w=880n
M14 N007 N010 0 0 NMOS l=180n w=440n
V6 N005 0 1.8
M15 N014 Q_OUT N017 N014 PMOS l=180n w=880n
M16 N017 Q_OUT 0 0 NMOS l=180n w=440n
V7 N014 0 1.8
M17 N015 N017 N011 N015 PMOS l=180n w=880n
M18 N011 N017 0 0 NMOS l=180n w=440n
V8 N015 0 1.8
V9 N012 0 1.8
M19 N003 Q_OUT P001 0 NMOS l=180n w=880n
M20 P001 RESET 0 0 NMOS l=180n w=880n
M21 N001 Q_OUT N003 N001 PMOS l=180n w=880n
M22 N001 RESET N003 N001 PMOS l=180n w=880n
V10 N001 0 1.8
M23 N016 CLOCK P002 0 NMOS l=180n w=880n
M24 P002 ENABLE 0 0 NMOS l=180n w=880n
M25 N013 CLOCK N016 N013 PMOS l=180n w=880n
M26 N013 ENABLE N016 N013 PMOS l=180n w=880n
V13 N013 0 1.8
M27 N001 N003 Q N001 PMOS l=180n w=880n
M28 Q N003 0 0 NMOS l=180n w=440n
M29 N013 N016 CLK N013 PMOS l=180n w=880n
M30 CLK N016 0 0 NMOS l=180n w=440n
V11 RESET 0 PULSE(1.8 0 0 10p 10p 5n 10n 6)
V12 ENABLE 0 PULSE(1.8 0 0 10p 10p 3n 6n 6)
V1 D 0 PULSE(1.8 0 0 10p 10p 1n 2n 12)
.tran 0 16ns 0
* LOT: n94s                  WAF: 08
* Temperature_parameters=Default
.MODEL nmos nmos LEVEL = 8
+VERSION = 3.1            TNOM    = 27             TOX     = 5.8E-9
+XJ      = 1E-7           NCH     = 2.3549E17      VTH0    = 0.4308936
+K1      = 0.3519429      K2      = 0.0298493      K3      = 1E-3
+K3B     = 0.0592323      W0      = 1E-5           NLX     = 1.465901E-7
+DVT0W   = 0              DVT1W   = 0              DVT2W   = 0
+DVT0    = 0.0183405      DVT1    = 4.897584E-3    DVT2    = -0.0252658
+U0      = 455.3033362    UA      = 5.223592E-10   UB      = 1.104713E-18
+UC      = 3.287888E-11   VSAT    = 1.050993E5     A0      = 1.2318623
+AGS     = 0.3043334      B0      = 6.67749E-8     B1      = 5E-6
+KETA    = 8.518046E-4    A1      = 0              A2      = 1
+RDSW    = 509.5675851    PRWG    = 0.0227558      PRWB    = -1E-3
+WR      = 1              WINT    = 2.126497E-9    LINT    = 4.393474E-9
+XL      = -3E-8          XW      = 0              DWG     = -3.409033E-9
+DWB     = 2.794842E-9    VOFF    = -0.1026054     NFACTOR = 0.1344887
+CIT     = 0              CDSC    = 1.527511E-3    CDSCD   = 0
+CDSCB   = 0              ETA0    = 3.48737E-3     ETAB    = 4.557986E-4
+DSUB    = 3.045473E-3    PCLM    = 1.0446257      PDIBLC1 = 0.1441952
+PDIBLC2 = 4.513382E-4    PDIBLCB = -2.816756E-5   DROUT   = 0.4698725
+PSCBE1  = 1.761109E10    PSCBE2  = 3.772916E-9    PVAG    = 0.0361824
+DELTA   = 0.01           MOBMOD  = 1              PRT     = 0
+UTE     = -1.5           KT1     = -0.11          KT1L    = 0
+KT2     = 0.022          UA1     = 4.31E-9        UB1     = -7.61E-18
+UC1     = -5.6E-11       AT      = 3.3E4          WL      = 0
+WLN     = 1              WW      = 0              WWN     = 1
+WWL     = 0              LL      = 0              LLN     = 1
+LW      = 0              LWN     = 1              LWL     = 0
+CAPMOD  = 2              XPART   = 0.4            CGDO    = 6.27E-10
+CGSO    = 6.27E-10       CGBO    = 0              CJ      = 1.918655E-3
+PB      = 0.9784049      MJ      = 0.4721729      CJSW    = 4.441595E-10
+PBSW    = 0.9419636      MJSW    = 0.2871118      PVTH0   = 1.342985E-3
+PRDSW   = -61.8357222    PK2     = -3.140724E-3   WKETA   = 7.512693E-4
+LKETA   = -6.144062E-3
* LOT: n94s                  WAF: 08
* Temperature_parameters=Default
.MODEL pmos pmos LEVEL = 8
+VERSION = 3.1            TNOM    = 27             TOX     = 5.8E-9
+XJ      = 1E-7           NCH     = 4.1589E17      VTH0    = -0.6158735
+K1      = 0.4598379      K2      = 0.0399415      K3      = 0
+K3B     = 8.7410723      W0      = 1E-6           NLX     = 1E-9
+DVT0W   = 0              DVT1W   = 0              DVT2W   = 0
+DVT0    = 0.6249485      DVT1    = 0.203296       DVT2    = -0.0513763
+U0      = 158.67524      UA      = 2.200024E-10   UB      = 4.457415E-18
+UC      = 1.02138E-10    VSAT    = 1.85064E5      A0      = 1.3826397
+AGS     = 0.4192977      B0      = 2.844099E-6    B1      = 5E-6
+KETA    = 0.0208695      A1      = 0              A2      = 1
+RDSW    = 968.5463       PRWG    = -0.1026483     PRWB    = -0.325
+WR      = 1              WINT    = 2.748811E-8    LINT    = 8.71907E-9
+XL      = -3E-8          XW      = 0              DWG     = -4.087585E-8
+DWB     = 2.032008E-8    VOFF    = -0.15          NFACTOR = 1.5460516
+CIT     = 0              CDSC    = 1.413317E-4    CDSCD   = 0
+CDSCB   = 0              ETA0    = 0.3241245      ETAB    = -0.1842
+DSUB    = 1.0287138      PCLM    = 5.2654567      PDIBLC1 = 4.228338E-3
+PDIBLC2 = 1.204519E-3    PDIBLCB = 2.37525E-3     DROUT   = 0
+PSCBE1  = 3.011456E10    PSCBE2  = 3.037042E-7    PVAG    = 8.9564294
+DELTA   = 0.01           MOBMOD  = 1              PRT     = 0
+UTE     = -1.5           KT1     = -0.11          KT1L    = 0
+KT2     = 0.022          UA1     = 4.31E-9        UB1     = -7.61E-18
+UC1     = -5.6E-11       AT      = 3.3E4          WL      = 0
+WLN     = 1              WW      = 0              WWN     = 1
+WWL     = 0              LL      = 0              LLN     = 1
+LW      = 0              LWN     = 1              LWL     = 0
+CAPMOD  = 2              XPART   = 0.4            CGDO    = 5.59E-10
+CGSO    = 5.59E-10       CGBO    = 0              CJ      = 1.882857E-3
+PB      = 0.9891317      MJ      = 0.4679789      CJSW    = 3.67186E-10
+PBSW    = 0.9884654      MJSW    = 0.3562128      PVTH0   = 3.923756E-3
+PRDSW   = 15.3953053     PK2     = 2.061759E-3    WKETA   = 4.10049E-3
+LKETA   = -0.0232426     LVSAT   = 1.257E5
.ends dff_with_cntrs

.model NMOS NMOS
.model PMOS PMOS
.lib standard.mos
* LOT: n94s                  WAF: 08
* Temperature_parameters=Default
.MODEL pmos pmos LEVEL = 8
+VERSION = 3.1            TNOM    = 27             TOX     = 5.8E-9
+XJ      = 1E-7           NCH     = 4.1589E17      VTH0    = -0.6158735
+K1      = 0.4598379      K2      = 0.0399415      K3      = 0
+K3B     = 8.7410723      W0      = 1E-6           NLX     = 1E-9
+DVT0W   = 0              DVT1W   = 0              DVT2W   = 0
+DVT0    = 0.6249485      DVT1    = 0.203296       DVT2    = -0.0513763
+U0      = 158.67524      UA      = 2.200024E-10   UB      = 4.457415E-18
+UC      = 1.02138E-10    VSAT    = 1.85064E5      A0      = 1.3826397
+AGS     = 0.4192977      B0      = 2.844099E-6    B1      = 5E-6
+KETA    = 0.0208695      A1      = 0              A2      = 1
+RDSW    = 968.5463       PRWG    = -0.1026483     PRWB    = -0.325
+WR      = 1              WINT    = 2.748811E-8    LINT    = 8.71907E-9
+XL      = -3E-8          XW      = 0              DWG     = -4.087585E-8
+DWB     = 2.032008E-8    VOFF    = -0.15          NFACTOR = 1.5460516
+CIT     = 0              CDSC    = 1.413317E-4    CDSCD   = 0
+CDSCB   = 0              ETA0    = 0.3241245      ETAB    = -0.1842
+DSUB    = 1.0287138      PCLM    = 5.2654567      PDIBLC1 = 4.228338E-3
+PDIBLC2 = 1.204519E-3    PDIBLCB = 2.37525E-3     DROUT   = 0
+PSCBE1  = 3.011456E10    PSCBE2  = 3.037042E-7    PVAG    = 8.9564294
+DELTA   = 0.01           MOBMOD  = 1              PRT     = 0
+UTE     = -1.5           KT1     = -0.11          KT1L    = 0
+KT2     = 0.022          UA1     = 4.31E-9        UB1     = -7.61E-18
+UC1     = -5.6E-11       AT      = 3.3E4          WL      = 0
+WLN     = 1              WW      = 0              WWN     = 1
+WWL     = 0              LL      = 0              LLN     = 1
+LW      = 0              LWN     = 1              LWL     = 0
+CAPMOD  = 2              XPART   = 0.4            CGDO    = 5.59E-10
+CGSO    = 5.59E-10       CGBO    = 0              CJ      = 1.882857E-3
+PB      = 0.9891317      MJ      = 0.4679789      CJSW    = 3.67186E-10
+PBSW    = 0.9884654      MJSW    = 0.3562128      PVTH0   = 3.923756E-3
+PRDSW   = 15.3953053     PK2     = 2.061759E-3    WKETA   = 4.10049E-3
+LKETA   = -0.0232426     LVSAT   = 1.257E5
* LOT: n94s                  WAF: 08
* Temperature_parameters=Default
.MODEL nmos nmos LEVEL = 8
+VERSION = 3.1            TNOM    = 27             TOX     = 5.8E-9
+XJ      = 1E-7           NCH     = 2.3549E17      VTH0    = 0.4308936
+K1      = 0.3519429      K2      = 0.0298493      K3      = 1E-3
+K3B     = 0.0592323      W0      = 1E-5           NLX     = 1.465901E-7
+DVT0W   = 0              DVT1W   = 0              DVT2W   = 0
+DVT0    = 0.0183405      DVT1    = 4.897584E-3    DVT2    = -0.0252658
+U0      = 455.3033362    UA      = 5.223592E-10   UB      = 1.104713E-18
+UC      = 3.287888E-11   VSAT    = 1.050993E5     A0      = 1.2318623
+AGS     = 0.3043334      B0      = 6.67749E-8     B1      = 5E-6
+KETA    = 8.518046E-4    A1      = 0              A2      = 1
+RDSW    = 509.5675851    PRWG    = 0.0227558      PRWB    = -1E-3
+WR      = 1              WINT    = 2.126497E-9    LINT    = 4.393474E-9
+XL      = -3E-8          XW      = 0              DWG     = -3.409033E-9
+DWB     = 2.794842E-9    VOFF    = -0.1026054     NFACTOR = 0.1344887
+CIT     = 0              CDSC    = 1.527511E-3    CDSCD   = 0
+CDSCB   = 0              ETA0    = 3.48737E-3     ETAB    = 4.557986E-4
+DSUB    = 3.045473E-3    PCLM    = 1.0446257      PDIBLC1 = 0.1441952
+PDIBLC2 = 4.513382E-4    PDIBLCB = -2.816756E-5   DROUT   = 0.4698725
+PSCBE1  = 1.761109E10    PSCBE2  = 3.772916E-9    PVAG    = 0.0361824
+DELTA   = 0.01           MOBMOD  = 1              PRT     = 0
+UTE     = -1.5           KT1     = -0.11          KT1L    = 0
+KT2     = 0.022          UA1     = 4.31E-9        UB1     = -7.61E-18
+UC1     = -5.6E-11       AT      = 3.3E4          WL      = 0
+WLN     = 1              WW      = 0              WWN     = 1
+WWL     = 0              LL      = 0              LLN     = 1
+LW      = 0              LWN     = 1              LWL     = 0
+CAPMOD  = 2              XPART   = 0.4            CGDO    = 6.27E-10
+CGSO    = 6.27E-10       CGBO    = 0              CJ      = 1.918655E-3
+PB      = 0.9784049      MJ      = 0.4721729      CJSW    = 4.441595E-10
+PBSW    = 0.9419636      MJSW    = 0.2871118      PVTH0   = 1.342985E-3
+PRDSW   = -61.8357222    PK2     = -3.140724E-3   WKETA   = 7.512693E-4
+LKETA   = -6.144062E-3
.tran 0 10ns 0
.backanno
.end